# Altium schematic sheet connectors.SchDoc
size A
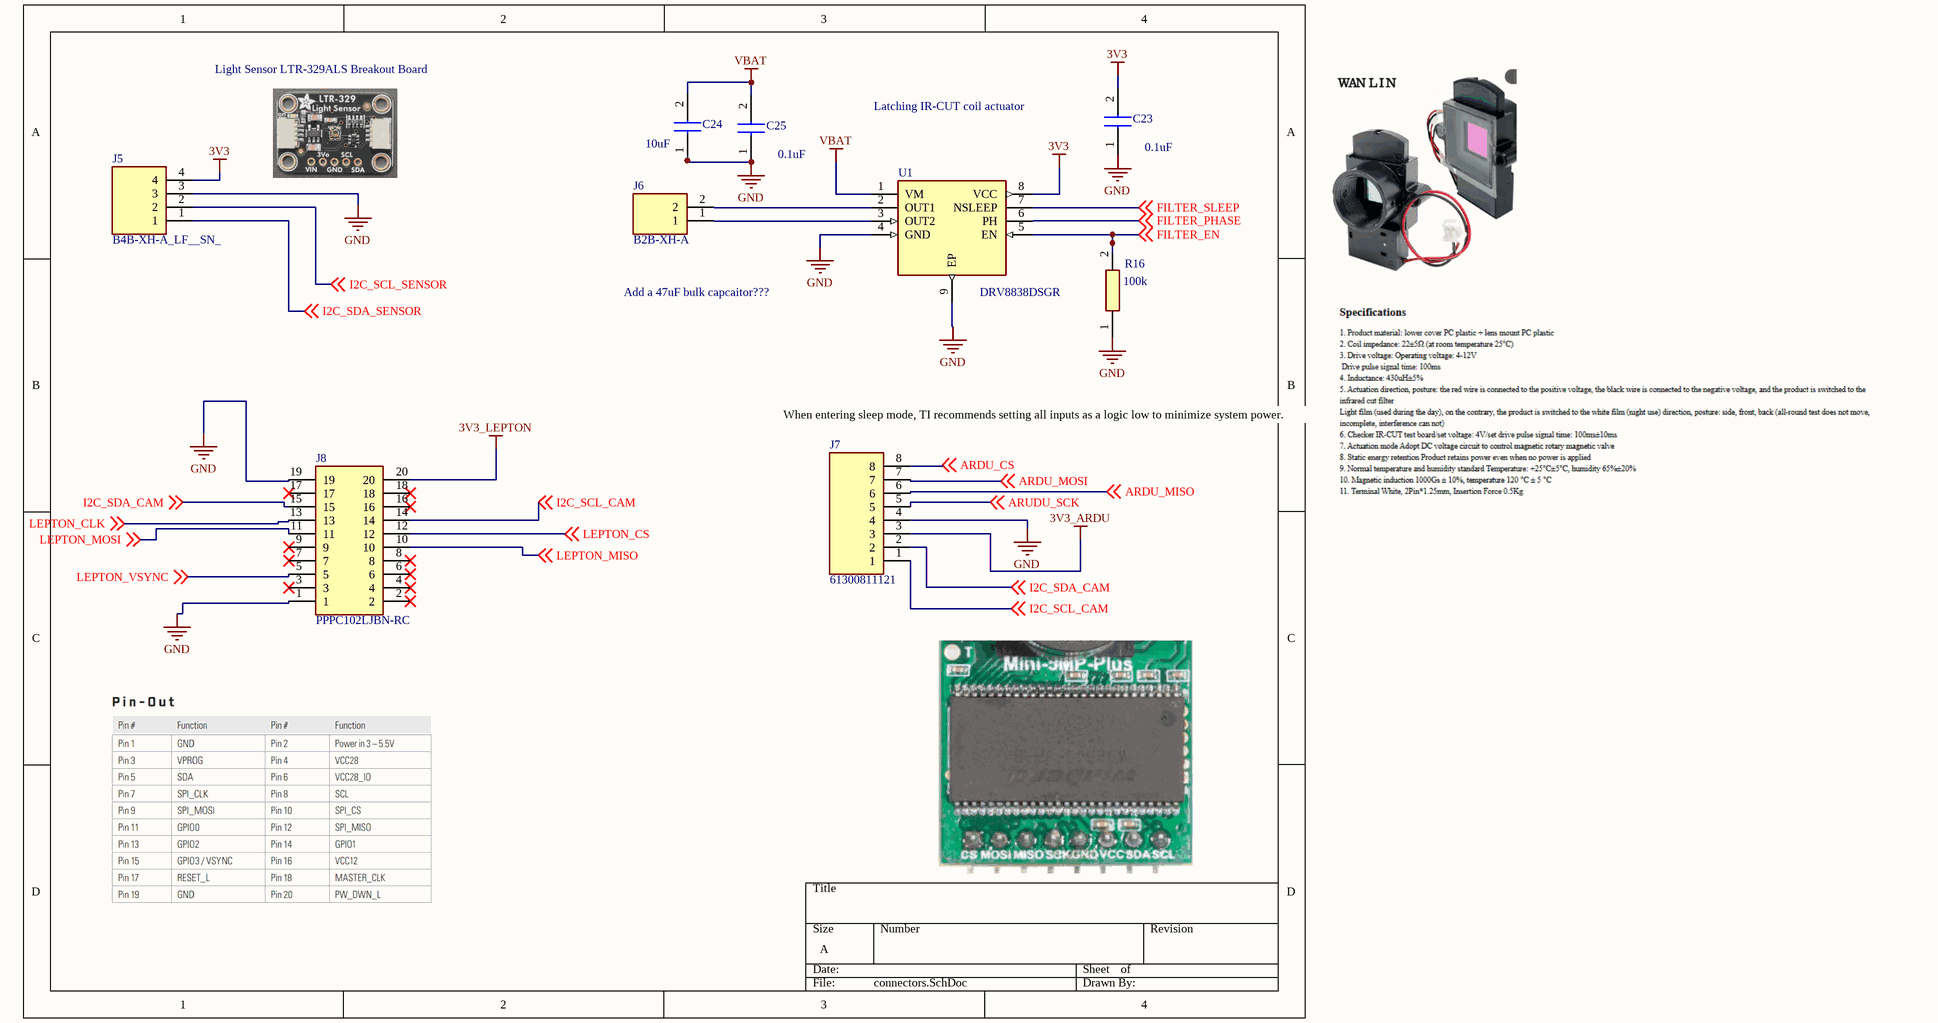
[diagram p0: connectors.SchDoc]

## Parts
C23  0.1uF  [CAPC1608X90N]
C24  10uF  [CAPC1608X90N]
C25  0.1uF  [CAPC1608X90N]
J5  B4B-XH-A_LF__SN_  [B4BXHALFSN]
J6  B2B-XH-A  [SHDR2W64P0X250_1X2_740X575X700P]
J7  61300811121  [HDRV8W64P0X254_1X8_2032X254X854P]
J8  PPPC102LJBN-RC  [RHDRRA20W60P254X254_2X10_2590X508X850P]
R16  100k  [RESC1608X55N]
U1  DRV8838DSGR  [SON50P200X200X80-9N]

## Nets
3V3: C23.2 J5.4 U1.8(VCC)
3V3_ARDU: J7.3
3V3_LEPTON: J8.20
GND: C23.1 C24.1 C25.1 J5.3 J7.4 J8.1 J8.19 R16.1 U1.4(GND) U1.9(EP)
VBAT: C24.2 C25.2 U1.1(VM)
ARDU_CS: J7.8 ; off-sheet ARDU_CS
ARDU_MISO: J7.6 ; off-sheet ARDU_MISO
ARDU_MOSI: J7.7 ; off-sheet ARDU_MOSI
ARUDU_SCK: J7.5 ; off-sheet ARUDU_SCK
FILTER_EN: R16.2 U1.5(EN) ; off-sheet FILTER_EN
FILTER_PHASE: U1.6(PH) ; off-sheet FILTER_PHASE
FILTER_SLEEP: U1.7(NSLEEP) ; off-sheet FILTER_SLEEP
I2C_SCL_CAM: J7.1 J8.14 ; off-sheet I2C_SCL_CAM
I2C_SCL_SENSOR: J5.2 ; off-sheet I2C_SCL_SENSOR
I2C_SDA_CAM: J7.2 J8.15 ; off-sheet I2C_SDA_CAM
I2C_SDA_SENSOR: J5.1 ; off-sheet I2C_SDA_SENSOR
LEPTON_CLK: J8.13 ; off-sheet LEPTON_CLK
LEPTON_CS: J8.12 ; off-sheet LEPTON_CS
LEPTON_MISO: J8.10 ; off-sheet LEPTON_MISO
LEPTON_MOSI: J8.11 ; off-sheet LEPTON_MOSI
LEPTON_VSYNC: J8.5 ; off-sheet LEPTON_VSYNC
NetJ6_1: J6.1 U1.3(OUT2)
NetJ6_2: J6.2 U1.2(OUT1)

Not connected (* = marked no-connect by the designer): J8 2* 3* 4* 6* 7* 8* 9* 16* 17* 18*

## Notes on the sheet
- Light Sensor LTR-329ALS Breakout Board
- Latching IR-CUT coil actuator
- Add a 47uF bulk capcaitor???
- (near J7) When entering sleep mode, TI recommends setting all inputs as a logic low to minimize system power.

## Library data of the parts
C23-C25 = CC0603KRX7R0BB104: 0603 CAP X5R 25V; Manufacturer_Name: YAGEO; Datasheet Link: https://www.yageo.com/upload/media/product/products/datasheet/mlcc/UPY-NP0X7R_MV_100-to-630V_21.pdf; Height: 0.9mm; Manufacturer_Part_Number: CC0603KRX7R0BB104; Mouser Part Number: 603-CC603KRX7R0BB104; Mouser Price/Stock: https://www.mouser.co.uk/ProductDetail/YAGEO/CC0603KRX7R0BB104?qs=5eucE5Hus%252BjO6dm3Y8T6pg%3D%3D; Arrow Part Number: CC0603KRX7R0BB104; Arrow Price/Stock: https://www.arrow.com/en/products/cc0603krx7r0bb104/yageo?region=nac
J5 = B4B-XH-A_LF__SN_: Connector; Manufacturer_Name: JST (JAPAN SOLDERLESS TERMINALS); Manufacturer_Part_Number: B4B-XH-A(LF)(SN); Datasheet Link: https://datasheet.lcsc.com/szlcsc/JST-Sales-America-B4B-XH-A-LF-SN_C144395.pdf; Height: 7mm; Mouser Part Number: 306-B4BXHALFSN; Mouser Price/Stock: https://www.mouser.co.uk/ProductDetail/JST-Commercial/B4B-XH-ALFSN?qs=cdbOS8ANM9CfC08d%252BywhFw%3D%3D; Arrow Part Number: B4B-XH-A(LF)(SN); Arrow Price/Stock: https://www.arrow.com/en/products/b4b-xh-a-lf-sn/jst-manufacturing?utm_currency=USD&region=europe
J6 = B2B-XH-A: Connector; Manufacturer_Name: JST (JAPAN SOLDERLESS TERMINALS); Datasheet Link: https://order.jst-mfg.com/InternetShop/app/pdf_show.php?kbn=3&key=XH%20CONNECTOR%20THROUGH-HOLE%20TYPE%20SHROUDED%20HEADER.pdf; Height: 7mm; Manufacturer_Part_Number: B2B-XH-A
J7 = 61300811121: Connector; Manufacturer_Name: Wurth Elektronik; Datasheet Link: https://www.we-online.com/components/products/download/3D_61300811121+%28rev1%29.pdf; Height: 8.54mm; Manufacturer_Part_Number: 61300811121; Mouser Part Number: 710-61300811121; Mouser Price/Stock: https://www.mouser.co.uk/ProductDetail/Wurth-Elektronik/61300811121?qs=PhR8RmCirEZRdx%252BVlEmRRA%3D%3D
J8 = PPPC102LJBN-RC: Connector; Manufacturer_Name: Sullins; Datasheet Link: https://drawings-pdf.s3.amazonaws.com/10494.pdf; Height: 8.5mm; Manufacturer_Part_Number: PPPC102LJBN-RC
R16 = RC0603FR0710KL: Resistor SMD 0603 1% 0.1W; Manufacturer_Name: YAGEO; Datasheet Link: http://www.yageo.com/documents/recent/PYu-RC0603_51_RoHS_L_v5.pdf; Height: 0.55mm; Manufacturer_Part_Number: RC0603FR0710KL; Arrow Part Number: RC0603FR0710KL; Arrow Price/Stock: https://www.arrow.com/en/products/rc0603fr-0710kl/yageo
U1 = DRV8838DSGR: Undefined or Miscellaneous; Manufacturer_Name: Texas Instruments; Datasheet Link: http://www.ti.com/lit/ds/symlink/drv8838.pdf; Height: 0.8mm; Manufacturer_Part_Number: DRV8838DSGR; Mouser Part Number: 595-DRV8838DSGR; Mouser Price/Stock: https://www.mouser.co.uk/ProductDetail/Texas-Instruments/DRV8838DSGR?qs=6E8igxPflKdSnWcv9OHrUQ%3D%3D; Arrow Part Number: DRV8838DSGR; Arrow Price/Stock: https://www.arrow.com/en/products/drv8838dsgr/texas-instruments?utm_currency=USD&region=nac